# Altium schematic sheet RELAYS.SchDoc
size B
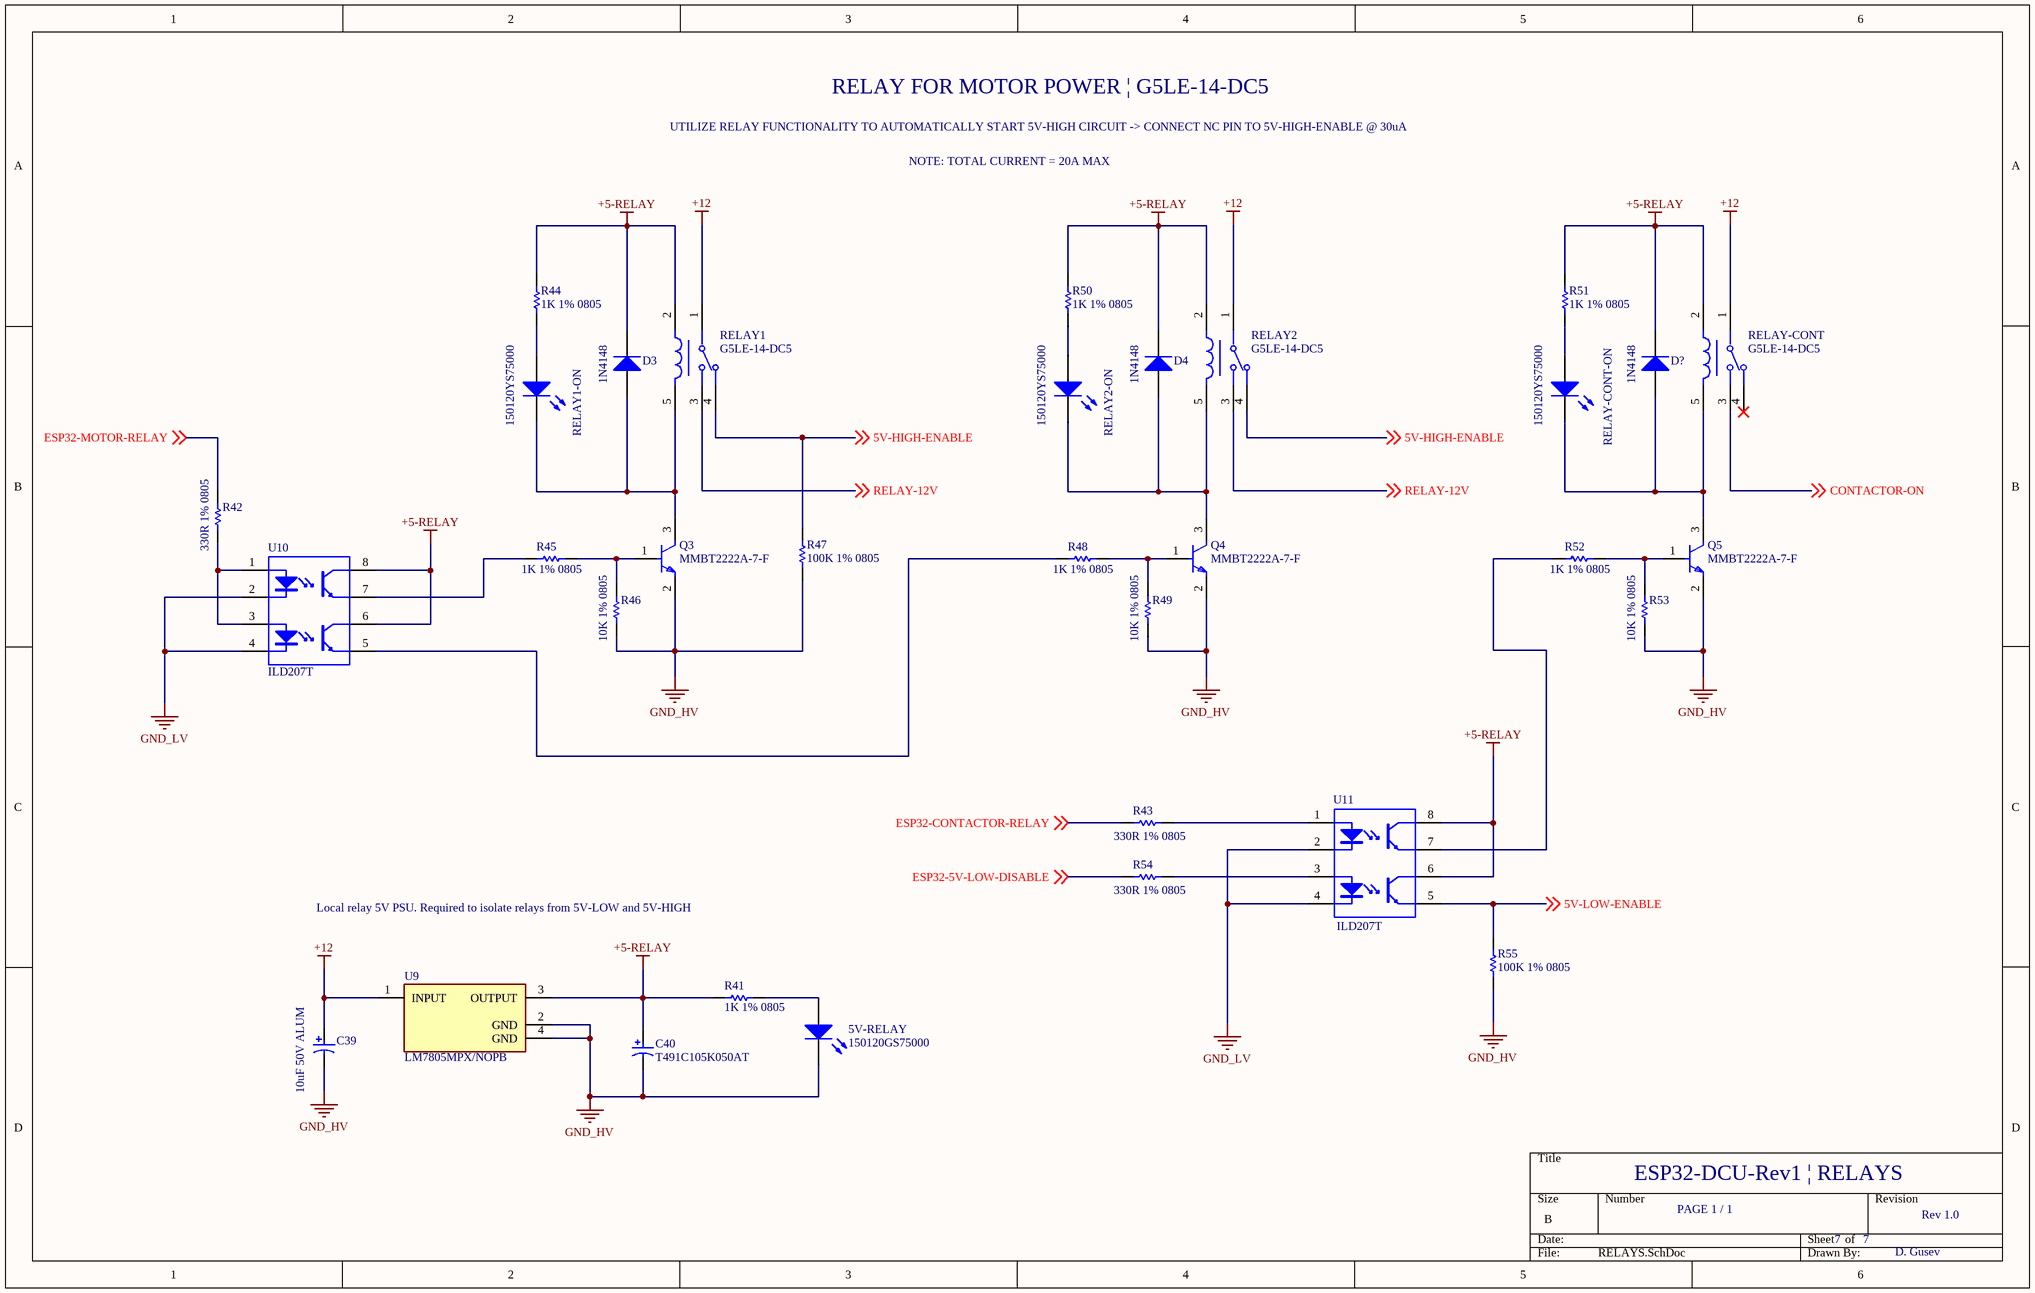
[diagram p0: RELAYS.SchDoc]

## Parts
5V-RELAY  150120GS75000  [1206_A]
C39  10uF 50V ALUM  [PNSC-FK-V-D_V]
C40  T491C105K050AT  [KEMT-T491-C_L]
D3  1N4148  [NXP-SOD27-2_V]
D4  1N4148  [NXP-SOD27-2_V]
D?  1N4148  [NXP-SOD27-2_V]
Q3  MMBT2222A-7-F  [FP-SOT23-IPC_A]
Q4  MMBT2222A-7-F  [FP-SOT23-IPC_A]
Q5  MMBT2222A-7-F  [FP-SOT23-IPC_A]
R41  1K 1% 0805  [RESC2013X60X40ML20T25]
R42  330R 1% 0805  [RESC2013X60X35LL10T20]
R43  330R 1% 0805  [RESC2013X60X35LL10T20]
R44  1K 1% 0805  [RESC2013X60X35ML10T20]
R45  1K 1% 0805  [RESC2013X60X35ML10T20]
R46  10K 1% 0805  [RESC2013X60X35NL10T20]
R47  100K 1% 0805  [RESC2013X60X35ML10T20]
R48  1K 1% 0805  [RESC2013X60X35ML10T20]
R49  10K 1% 0805  [RESC2013X60X35NL10T20]
R50  1K 1% 0805  [RESC2013X60X35ML10T20]
R51  1K 1% 0805  [RESC2013X60X35ML10T20]
R52  1K 1% 0805  [RESC2013X60X35ML10T20]
R53  10K 1% 0805  [RESC2013X60X35NL10T20]
R54  330R 1% 0805  [RESC2013X60X35LL10T20]
R55  100K 1% 0805  [RESC2013X60X35ML10T20]
RELAY1  G5LE-14-DC5  [FP-G5LE-14-DC5-MFG]
RELAY1-ON  150120YS75000  [1206_A]
RELAY2  G5LE-14-DC5  [FP-G5LE-14-DC5-MFG]
RELAY2-ON  150120YS75000  [1206_A]
RELAY-CONT  G5LE-14-DC5  [FP-G5LE-14-DC5-MFG]
RELAY-CONT-ON  150120YS75000  [1206_A]
U9  LM7805MPX/NOPB  [FP-LM7805MPX-NOPB-MFG]
U10  ILD207T  [VISH-SOIC-8_C_V]
U11  ILD207T  [VISH-SOIC-8_C_V]

## Nets
+5-RELAY: C40.1 D3.2(K) D4.2(K) D?.2(K) R41.1 R44.1 R50.1 R51.1 RELAY1.2 RELAY2.2 RELAY-CONT.2 U9.3(OUTPUT) U10.6(C) U10.8(C) U11.6(C) U11.8(C)
+12: C39.1 RELAY1.1 RELAY2.1 RELAY-CONT.1 U9.1(INPUT)
GND_HV: 5V-RELAY.1(K) C39.2 C40.2 Q3.2(E) Q4.2(E) Q5.2(E) R46.1 R47.1 R49.1 R53.1 R55.1 U9.2(GND) U9.4(GND)
GND_LV: U10.2(K) U10.4(K) U11.2(K) U11.4(K)
5V-HIGH-ENABLE: R47.2 RELAY1.4 RELAY2.4 ; off-sheet 5V-HIGH-ENABLE
5V-LOW-ENABLE: R55.2 U11.5(E) ; off-sheet 5V-LOW-ENABLE
CONTACTOR-ON: RELAY-CONT.3 ; off-sheet CONTACTOR-ON
ESP32-5V-LOW-DISABLE: R54.1 ; off-sheet ESP32-5V-LOW-DISABLE
ESP32-CONTACTOR-RELAY: R43.1 ; off-sheet ESP32-CONTACTOR-RELAY
ESP32-MOTOR-RELAY: R42.1 ; off-sheet ESP32-MOTOR-RELAY
RELAY-12V: RELAY1.3 RELAY2.3 ; off-sheet RELAY-12V
Net5V-RELAY_2: 5V-RELAY.2(A) R41.2
NetD3_1: D3.1(A) Q3.3(C) RELAY1.5 RELAY1-ON.1(K)
NetD4_1: D4.1(A) Q4.3(C) RELAY2.5 RELAY2-ON.1(K)
NetD?_1: D?.1(A) Q5.3(C) RELAY-CONT.5 RELAY-CONT-ON.1(K)
NetQ3_1: Q3.1(B) R45.2 R46.2
NetQ4_1: Q4.1(B) R48.2 R49.2
NetQ5_1: Q5.1(B) R52.2 R53.2
NetR42_2: R42.2 U10.1(A) U10.3(A)
NetR43_2: R43.2 U11.1(A)
NetR44_2: R44.2 RELAY1-ON.2(A)
NetR45_1: R45.1 U10.7(E)
NetR48_1: R48.1 U10.5(E)
NetR50_2: R50.2 RELAY2-ON.2(A)
NetR51_2: R51.2 RELAY-CONT-ON.2(A)
NetR52_1: R52.1 U11.7(E)
NetR54_2: R54.2 U11.3(A)

Not connected (* = marked no-connect by the designer): RELAY-CONT 4*

## Notes on the sheet
- RELAY FOR MOTOR POWER | G5LE-14-DC5
- UTILIZE RELAY FUNCTIONALITY TO AUTOMATICALLY START 5V-HIGH CIRCUIT -> CONNECT NC PIN TO 5V-HIGH-ENABLE @ 30uA
- NOTE: TOTAL CURRENT = 20A MAX
- Local relay 5V PSU. Required to isolate relays from 5V-LOW and 5V-HIGH
- ESP32-DCU-Rev1 | RELAYS
- PAGE 1 / 1
- 7
- Rev 1.0
- D. Gusev

## Library data of the parts
5V-RELAY = CMP-1426-00014-1: SMD mono-color Chip LED, WL-SMCW, Green; Manufacturer: Wuerth Elektronik; PackageReference: 1206_A; PartNumber: 150120GS75000; ComponentLink1Description: Manufacturer URL; ComponentLink2URL: http://katalog.we-online.com/led/datasheet/150120GS75000.pdf; ComponentLink2Description: Datasheet; Color: Green; ComponentLink1URL: http://www.we-online.com
C39 = CMP-2000-06207-1: Aluminum Electrolytic Capacitor, 10 uF, +/- 20%, 50 V, 2-Pin SMD (Size Code D), -55 to 105 degC, RoHS, Tape and Reel; Manufacturer: Panasonic; Lifetime@Temperature: 2000Hrs@105°C; Type: Can; Ripple Current: 165mA; Impedance: 0.88O; Capacitance: 10µF; Manufacturer URL: http://www.panasonic.com/; Mounting Technology: SurfaceMount; Rated Voltage: 50V; Datasheet URL: http://industrial.panasonic.com/cdbs/www-data/pdf/RDE0000/ABA0000C1181.pdf; Package Reference: FK-V-D; Series: FK; Operating Temp Range: -55to+105°C; Operating Temp-Max: 105°C; Datasheet Version: 03/2016; Package URL: http://industrial.panasonic.com/cdbs/www-data/pdf/RDE0000/DME0000COL48.pdf; Case Size/Dimension: Ø6.3x5.8mm; Package Description: 2-Pin Electrolytic Aluminum Capacitor, Body 6.6 x 6.6 mm
C40 = CMP-2000-07195-1: Tantalum Capacitor, 1 uF, +/- 10%, 50 V, -55 to 125 degC, 2-Pin SMD, RoHS, Tape and Reel; Manufacturer: Kemet; Capacitance: 1000000pF; Rad Hardened: No; Case Style: Molded; Product Diameter (mm): NotRequiredmm; Seal: NotRequired; DF: 4%; ESR: 5.5ohm; DCL: 0.5uA; Product Length (mm): 6mm; Product Height (mm): 2.5mm; Polarity: Polar; Voltage: 50VDC; Product Depth (mm): 3.2mm; Operating Temp Range: -55Cto125C; Package Description: 2-Pin Surface Mount Device, Body 6 x 3.2 mm; Failure Rate: NotRequired; Seated Plane Height: NotRequiredmm; Lead Spacing (nom): NotRequiredmm; Packaging: TapeandReel; Case Code: C; Length W/Weld: NotRequiredmm; Tolerance (+ or -): 10%; Datasheet URL: http://capacitoredge.kemet.com/capedge2/DataSheet/Datasheet-T491C105K050AT.pdf?pn=T491C105K050AT; Datasheet Version: 10/2016; Manufacturer URL: http://www.kemet.com/; Wire Form: NotRequired; Package / Case: 6032-28; Mounting Technology: SurfaceMount; Construction: SMTChip; Package Reference: T491-C; Length W/Weld (max): NotRequiredmm; Insulation: NotRequired; Mounting Style: SurfaceMount
D3 D4 D? = CMP-0648-00002-1: High-speed Diode, 100 V, 450 mA, 2-Pin SOD27, RoHS; Manufacturer: NXP Semiconductors; Configuration: Single; IR (VR: 20 V)=25 nA; IFRM: 450 mA; IFSM: 4 A Max.; Trr: 4 ns Max.; Cd: 4 pF Max.; VR: 100 V Max.; VF (IF: 10 mA)=1 V; IF: 200 mA Max.; ComponentLink1Description: Manufacturer URL; RoHS: TRUE; ComponentLink1URL: http://www.nxp.com/; ComponentLink3Description: Package Specification; DatasheetVersion: Aug-04; ComponentLink2Description: Datasheet; PackageVersion: Aug-04; PackageReference: SOD27; ComponentLink3URL: http://www.nxp.com/documents/data_sheet/1N4148_1N4448.pdf; Mounting Technology: Through Hole; ComponentLink2URL: http://www.nxp.com/documents/data_sheet/1N4148_1N4448.pdf; PartNumber: 1N4148; PackageDescription: 2-Pin Hermetically Sealed Glass Package, Axial Leaded, Dia 1.85 mm, Body Length 4.25 mm, Lead Spread 25.4 mm
Q3-Q5 = CMP-12798-000050-1: TRANS NPN 40V 0.6A SMD SOT23-3; Number of Elements: 1; Frequency: 300MHz; Max Collector Current: 600mA; Collector Base Voltage (VCBO): 75V; Current: 1A; Element Configuration: Single; Power Dissipation: 350mW; hFE Min: 100; Collector Emitter Saturation Voltage: 1V; Max Power Dissipation: 300mW; Emitter Base Voltage (VEBO): 6V; Voltage: 40V; Collector Emitter Breakdown Voltage: 40V; Width: 1.4mm; Polarity: NPN; Termination: SMD/SMT; Max Operating Temperature: 150°C; Transition Frequency: 300MHz; Contact Plating: Tin; Mount: Surface Mount; Max Frequency: 300MHz; Case/Package: SOT-23; Gain Bandwidth Product: 300MHz; Lead Free: Lead Free; Collector Emitter Voltage (VCEO): 40V; Radiation Hardening: No; Voltage Rating (DC): 40V; Height: 1mm; Max Breakdown Voltage: 40V; Packaging: Tape and Reel; Length: 3.05mm; Min Operating Temperature: -55°C; Weight: 0.000282oz; Current Rating: 600mA; REACH SVHC: No SVHC; Package Quantity: 3000; Continuous Collector Current: 600mA; Number of Pins: 3
R41 = CMP-2001-00590-1: Part Number: ERA6AEB123V; Manufacturer: Panasonic
R42 R43 R54 = CMP-2000-06960-1: Chip Resistor, 330 Ohm, +/- 1%, 125 mW, -55 to 155 degC, 0805 (2012 Metric), RoHS, Tape and Reel; Manufacturer: Yageo; Voltage Rating: 150V; Temperature Coefficient: 100PPM/C; Power Rating: 125mW(1/8W); Resistance: 330Ohms; Datasheet Version: Rev. 7, 05/2017; Termination Style: SMD/SMT; Case Code - mm: 2012; Package Description: 2-Pin Surface Mounted Device, Body 2 x 1.25 mm; Operating Temperature Range: -55Cto+155C; Case Code - in: 0805; Packaging: Reel; Tolerance: 1%; Package Reference: 0805; Mounting Technology: SurfaceMount; Product: ThickFilmResistorsGeneralPurpose; Series: RC; Manufacturer URL: http://www.yageo.com/; Datasheet URL: http://www.yageo.com/documents/recent/PYu-RC_Group_51_RoHS_L_7.pdf
R44 R45 R48 R50-R52 = CMP-2100-03671-1: Chip Resistor, 1 KOhm, +/- 1%, 125 mW, -55 to 155 degC, 0805 (2012 Metric), RoHS, Tape and Reel; Manufacturer: Yageo; Temperature Coefficient: 100ppm/degreesC; Voltage Rating (DC): 150V; Max Power Dissipation: 125mW; Resistance: 1KOhm; Number of Pins: 2; Number of Terminations: 2; Datasheet URL: http://www.yageo.com/NewPortal/yageodocoutput?fileName=/pdf/R-Chip/PYu-RC_Group_51_RoHS_L_5.pdf; Length: 0.079inch; Package Description: 2-Pin Surface Mounted Device, Body 2 x 1.25 mm; Depth: 1.25mm; Height: 0.024inch; Military Standard: Not; Case/Package: 0805; Package Reference: 0805; RoHSCompliant: true; Lead Free: LeadFree; Packaging: TapeandReel; Package Quantity: 1; Datasheet Version: Rev. 5, 10/2016; Tolerance: 1%; Min Operating Temperature: -55degC; Voltage Rating: 150V; Composition: ThickFilm; Case Code (Imperial): 0805; Power Rating: 125mW; Width: 0.049inch; Case Code (Metric): 2012; Manufacturer URL: http://www.yageo.com/; Max Operating Temperature: 155degC; REACH SVHC: Unknown; Termination: SMD/SMT
R46 R49 R53 = CMP-1659-00013-4: Chip Resistor, 10 KOhm, +/- 1%, 0.125 W, -55 to 155 degC, 0805 (2012 Metric), RoHS, Tape and Reel; Manufacturer: Yageo; Voltage Rating: 150 V; Mount: Surface Mount; ComponentLink1Description: Manufacturer URL; ComponentLink2URL: http://www.yageo.com/documents/recent/PYu-RC_Group_51_RoHS_L_04.pdf; Pins: 2; Length: 2 mm; Min Operating Temperature: -55 degC; Height: 0.5 mm; Mounting Technology: Surface Mount; RoHSCompliant: true; REACH SVHC: No SVHC; ComponentLink1URL: http://www.yageo.com/; Max Operating Temperature: 155 degC; PackageReference: 0805; DatasheetVersion: Rev. 4, 02/2016; Package Quantity: 5000; Packaging: Tape and Reel; ComponentLink2Description: Datasheet; PackageDescription: 2-Pin Surface Mounted Device, Body 2 x 1.25 mm
R47 R55 = CMP-2100-03668-1: Chip Resistor, 100 KOhm, +/- 1%, 0.125 W, -55 to 155 degC, 0805 (2012 Metric), RoHS, Tape and Reel; Manufacturer: Yageo; Max Power Dissipation: 125mW; Voltage Rating: 150V; Temperature Coefficient: 100ppm/degreesC; Manufacturer URL: http://www.yageo.com/; Min Operating Temperature: -55degC; Lead Pitch: 0.4mm; Composition: ThickFilm; Case Code (Metric): 2012; Military Standard: Not; Package Description: 2-Pin Surface Mounted Device, Body 2 x 1.25 mm; REACH SVHC: Unknown; RoHSCompliant: true; Depth: 1.25mm; Number of Pins: 2; Lead Free: LeadFree; Resistance: 100KOhm; Datasheet URL: http://www.yageo.com/NewPortal/yageodocoutput?fileName=/pdf/R-Chip/PYu-RC_Group_51_RoHS_L_5.pdf; Max Operating Temperature: 155degC; Case/Package: 0805; Package Quantity: 1; Case Code (Imperial): 0805; Power Rating: 125mW; Width: 0.049inch; Package Reference: 0805; Height: 0.024inch; Termination: SMD/SMT; Tolerance: 1%; Datasheet Version: Rev. 5, 10/2016; Length: 2mm; Voltage Rating (DC): 150V; Number of Terminations: 2; Packaging: TapeandReel
RELAY1 RELAY2 RELAY-CONT = CMP-08822-000008-1: RELAY GEN PURPOSE SPDT 10A 5V; Manufacturer: Omron; Number Of Contacts: 1; Coil Type: Non-Latching; Coil Current: 79.4mA; Coil Power: 400mW; Coil Resistance: 63Ω; Standoff Height: 0.5mm; Throw Configuration: SPDT; Ambient Temperature Range Low: -25°C; Package: 0; Device Class L2: Relays; Temperature Range High: +85°C; ComponentLink2Description: Datasheet; Octopart: https://octopart.com/g5le-14-dc5-omron-28829; Coil Voltage: 5V; Lead Free: Yes; Digikey Description: RELAY GEN PURPOSE SPDT 10A 5V; Device Class L1: Electromechanical; Device Class L3: Power Relays; ComponentLink2URL: https://omronfs.omron.com/en_US/ecb/products/pdf/en-g5le.pdf; Temperature: -25°C to +85°C; Ambient Temperature Range High: +85°C; RoHS: TRUE; Automotive: No; Height: 19mm; Category: Relay; Manufacturer Part Number: G5LE-14-DC5; Mouser Description: General Purpose Relays Power PCB Relay SPDT Sealed 5VDC; Current Rating: 10A; Switching Current: 10A; Temperature Range Low: -25°C
RELAY1-ON RELAY2-ON RELAY-CONT-ON = CMP-1426-00019-1: SMD mono-color Chip LED, WL-SMCW, Yellow; Manufacturer: Wuerth Elektronik; ComponentLink2URL: http://katalog.we-online.com/led/datasheet/150120YS75000.pdf; PartNumber: 150120YS75000; ComponentLink1URL: http://www.we-online.com; Color: Yellow; ComponentLink1Description: Manufacturer URL; PackageReference: 1206_A; ComponentLink2Description: Datasheet
U9 = CMP-04917-000022-1: IC REG LINEAR 5V 1.5A SOT223-4; Manufacturer: Texas Instruments; Dropout Voltage: 2V; Output Type: Fixed; Accuracy Percentage: 3%; Description: Linear Voltage Regulator IC  1 Output  1.5A SOT-223-4; Nominal Supply Current: 8mA; Standoff Height: 0.02mm; Min Supply Voltage: 7.5V; Number Of Outputs: 1; Max Junction Temp: +150°C; Max Supply Voltage: 30V; Height: 1.8mm; Temperature Range High: +125°C; Device Class L3: Voltage Regulators - Linear; Lead Free: Yes; Digikey Description: IC REG LINEAR 5V 1.5A SOT223-4; Output Current: 1.5A; Manufacturer Part Number: LM7805MPX/NOPB; Automotive: No; Device Class L1: Integrated Circuits (ICs); ComponentLink2Description: Datasheet; Device Class L2: Power Management ICs; Category: IC; Octopart: https://octopart.com/lm7805mpx%2Fnopb-texas+instruments-74629992; Package: SOT223-4; RoHS: TRUE; Output Voltage: 5V; Temperature Range Low: 0°C; Temperature: 0°C to +125°C; ComponentLink2URL: http://www.ti.com/lit/ds/symlink/lm7800.pdf
U10 U11 = CMP-2000-06453-1: Optocoupler, Phototransistor Output, Dual Channel, 4000 VRMS, -55 to 100 degC, 8-Pin SOIC, RoHS, Tape and Reel; Manufacturer: Vishay; Voltage - Output (Max): 70V; Vce Saturation (Max): 400mV; Number of Channels: 2; Voltage - Forward (Vf) (Typ): 1.2V; EDA / CAD Models: DownloadfromAcceleratedDesigns; Current Transfer Ratio (Min): 100%@10mA; Current Transfer Ratio (Max): 200%@10mA; Input Type: DC; Current - DC Forward (If) (Max): 30mA; Rise / Fall Time (Typ): 3µs,4.7µs; Turn On / Turn Off Time (Typ): 6µs,5µs; Catalog Drawings: OptocouplerCircuit; Other Names: 751-1310-1ILD207TGICTILD207TGICT-ND; Online Catalog: ILD205T,206T,207T,211T,213T,217TSeries; Mounting Type: SurfaceMount; Package Description: 8-Pin Small Outline Integrated Circuit, Body 5.84 x 3.91 mm, Pitch 1.27 mm; Output Type: Transistor; Package / Case: 8-SOIC(0.154",3.90mmWidth); Category: Isolators; Operating Temperature: -55°C~100°C; Family: Optoisolators-Transistor,PhotovoltaicOutput; Package Reference: SOIC-8; Voltage - Isolation: 4000Vrms; Supplier Device Package: 8-SOIC; Standard Package: 1; Manufacturer URL: http://www.vishay.com/; Series: -; Packaging: CutTape(CT); Datasheet Version: Rev. 2.1, 10/2015; Datasheet URL: http://www.vishay.com/docs/83647/ild205t.pdf; Mounting Technology: SurfaceMount; Current - Output / Channel: -